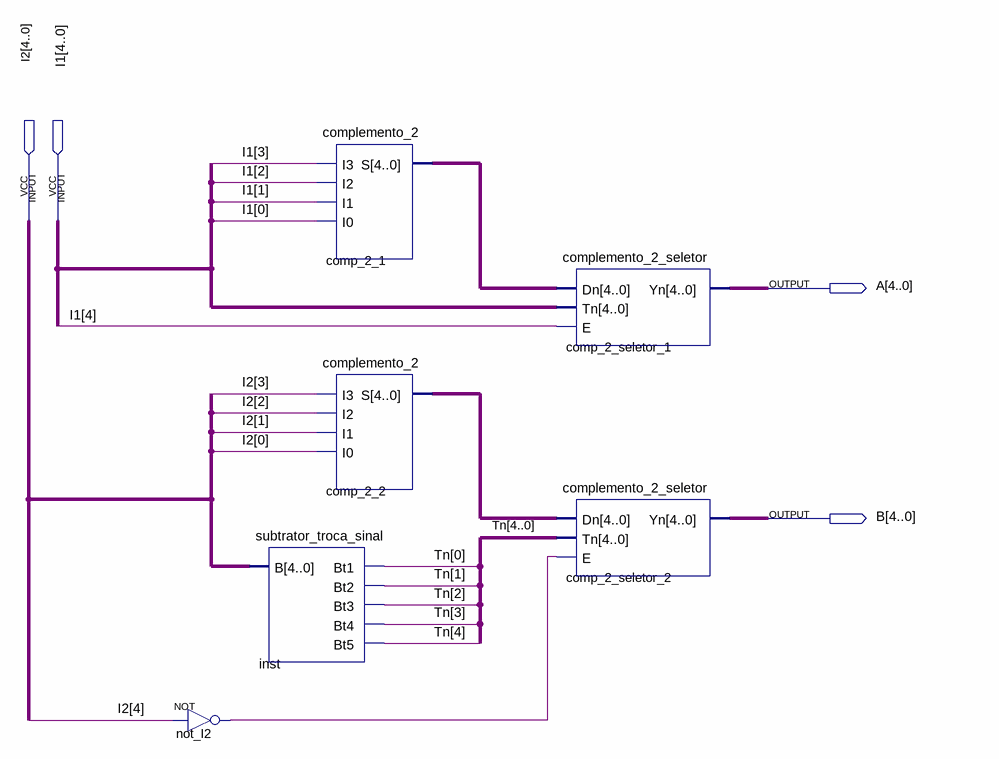
[diagram p0: schematic sheet]
// Quartus schematic subtrator_checagem.bdf as structural Verilog: 6 symbols, 4 pins
module subtrator_checagem (
  input  [4:0] I2,
  input  [4:0] I1,
  output [4:0] A,
  output [4:0] B
);

  wire not_I2_out;
  wire [4:0] comp_2_1_s, comp_2_2_s, Tn;

  not not_I2 (not_I2_out, I2[4]);
  subtrator_troca_sinal inst (.B(I2), .Bt1(Tn[0]), .Bt2(Tn[1]), .Bt3(Tn[2]), .Bt4(Tn[3]), .Bt5(Tn[4]));
  complemento_2 comp_2_1 (.I3(I1[3]), .I2(I1[2]), .I1(I1[1]), .I0(I1[0]), .S(comp_2_1_s));
  complemento_2 comp_2_2 (.I3(I2[3]), .I2(I2[2]), .I1(I2[1]), .I0(I2[0]), .S(comp_2_2_s));
  complemento_2_seletor comp_2_seletor_1 (.Dn(comp_2_1_s), .Tn(I1), .E(I1[4]), .Yn(A));
  complemento_2_seletor comp_2_seletor_2 (.Dn(comp_2_2_s), .Tn(Tn), .E(not_I2_out), .Yn(B));
endmodule
